# EAGLE design controle (EAGLE 4.11)
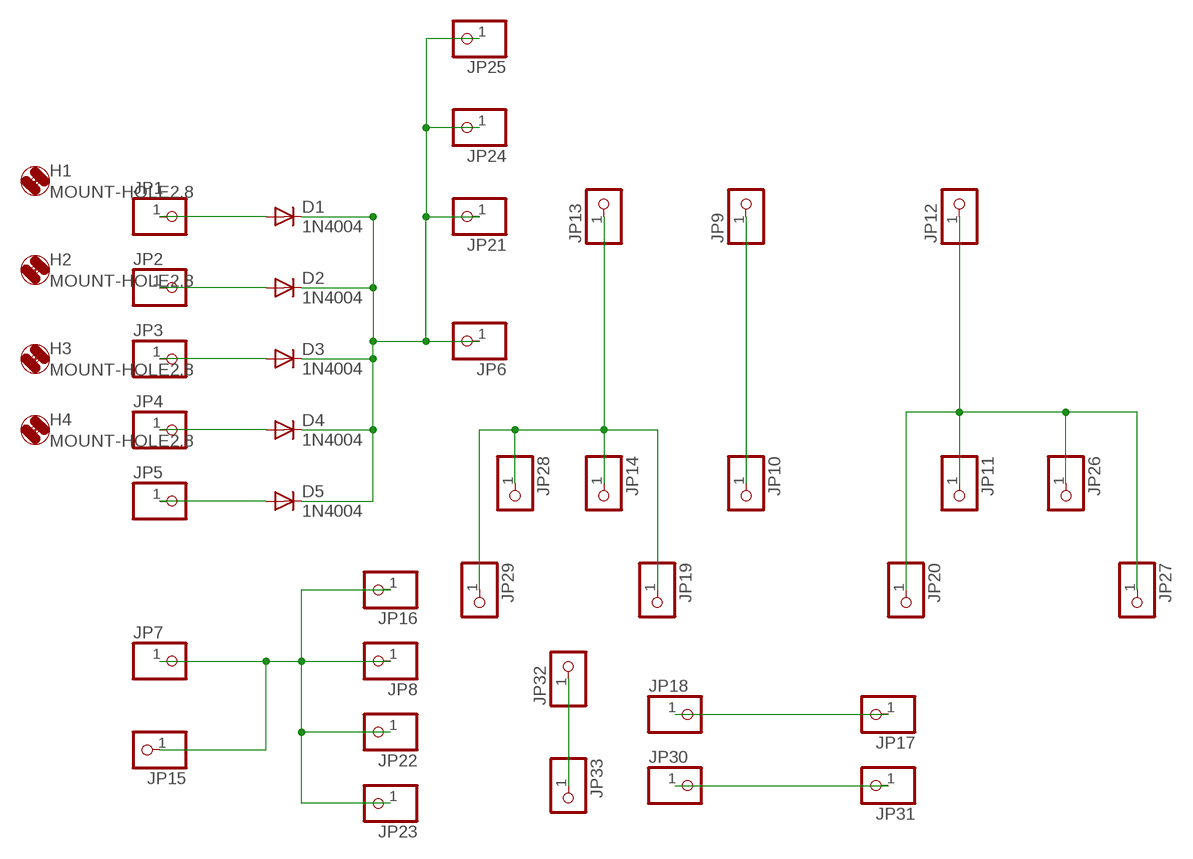
[diagram p0: schematic, sheet 1]

## Parts
D1  1N4004  [DO41-10]
D2  1N4004  [DO41-10]
D3  1N4004  [DO41-10]
D4  1N4004  [DO41-10]
D5  1N4004  [DO41-10]
H1  MOUNT-HOLE2.8  [2,8]
H2  MOUNT-HOLE2.8  [2,8]
H3  MOUNT-HOLE2.8  [2,8]
H4  MOUNT-HOLE2.8  [2,8]
JP1  PINHD-1X1  [1X01]
JP2  PINHD-1X1  [1X01]
JP3  PINHD-1X1  [1X01]
JP4  PINHD-1X1  [1X01]
JP5  PINHD-1X1  [1X01]
JP6  PINHD-1X1  [1X01]
JP7  PINHD-1X1  [1X01]
JP8  PINHD-1X1  [1X01]
JP9  PINHD-1X1  [1X01]
JP10  PINHD-1X1  [1X01]
JP11  PINHD-1X1  [1X01]
JP12  PINHD-1X1  [1X01]
JP13  PINHD-1X1  [1X01]
JP14  PINHD-1X1  [1X01]
JP15  PINHD-1X1  [1X01]
JP16  PINHD-1X1  [1X01]
JP17  PINHD-1X1  [1X01]
JP18  PINHD-1X1  [1X01]
JP19  PINHD-1X1  [1X01]
JP20  PINHD-1X1  [1X01]
JP21  PINHD-1X1  [1X01]
JP22  PINHD-1X1  [1X01]
JP23  PINHD-1X1  [1X01]
JP24  PINHD-1X1  [1X01]
JP25  PINHD-1X1  [1X01]
JP26  PINHD-1X1  [1X01]
JP27  PINHD-1X1  [1X01]
JP28  PINHD-1X1  [1X01]
JP29  PINHD-1X1  [1X01]
JP30  PINHD-1X1  [1X01]
JP31  PINHD-1X1  [1X01]
JP32  PINHD-1X1  [1X01]
JP33  PINHD-1X1  [1X01]

## Nets
N$1: D1.A JP1.1
N$2: D2.A JP2.1
N$3: D3.A JP3.1
N$4: D4.A JP4.1
N$5: D5.A JP5.1
N$6: JP7.1 JP8.1 JP15.1 JP16.1 JP22.1 JP23.1
N$7: D1.C D2.C D3.C D4.C D5.C JP6.1 JP21.1 JP24.1 JP25.1
N$8: JP13.1 JP14.1 JP19.1 JP28.1 JP29.1
N$9: JP9.1 JP10.1
N$10: JP11.1 JP12.1 JP20.1 JP26.1 JP27.1
N$11: JP32.1 JP33.1
N$13: JP17.1 JP18.1
N$14: JP30.1 JP31.1

## Library data of the parts
D1-D5 = diode:1N4004: DIODE general purpose rectifier, 1 A
H1-H4 = holes:MOUNT-HOLE: MOUNTING HOLE with drill center marker
JP1-JP33 = pinhead:PINHD-1X1: PIN HEADER

## Board
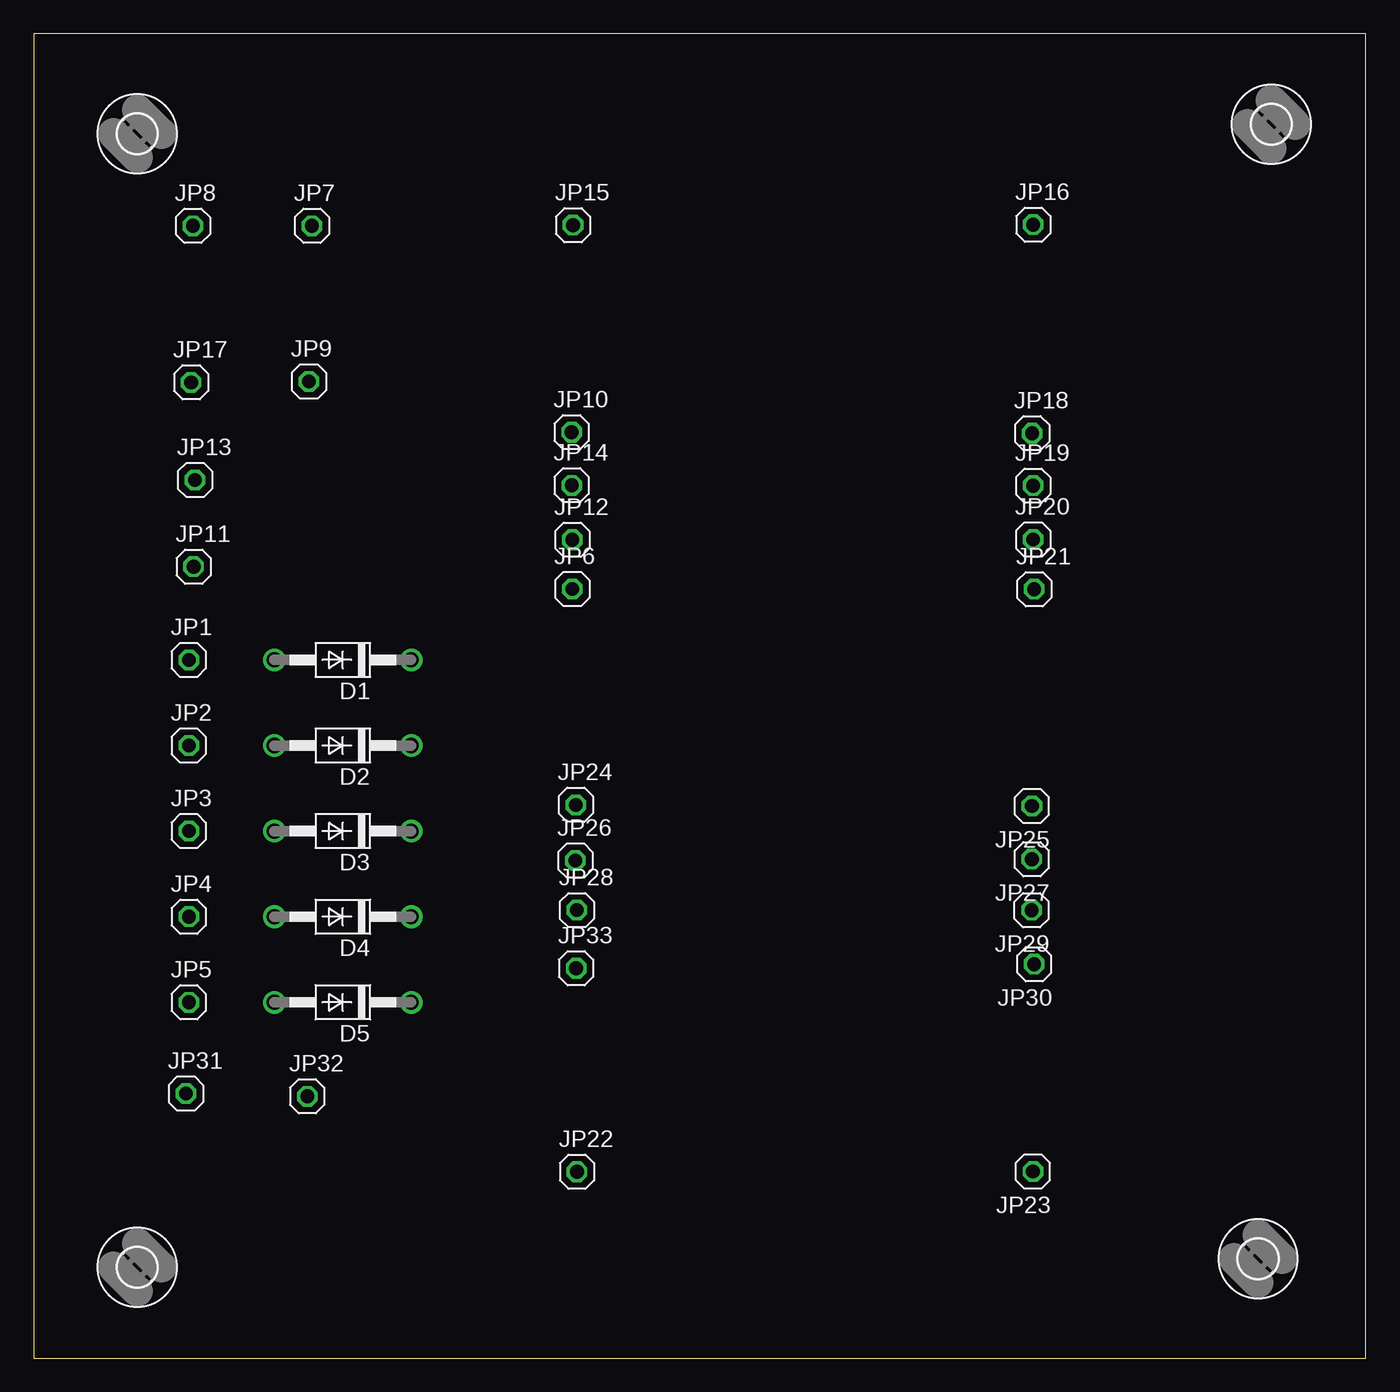
[diagram p1: board, top side]
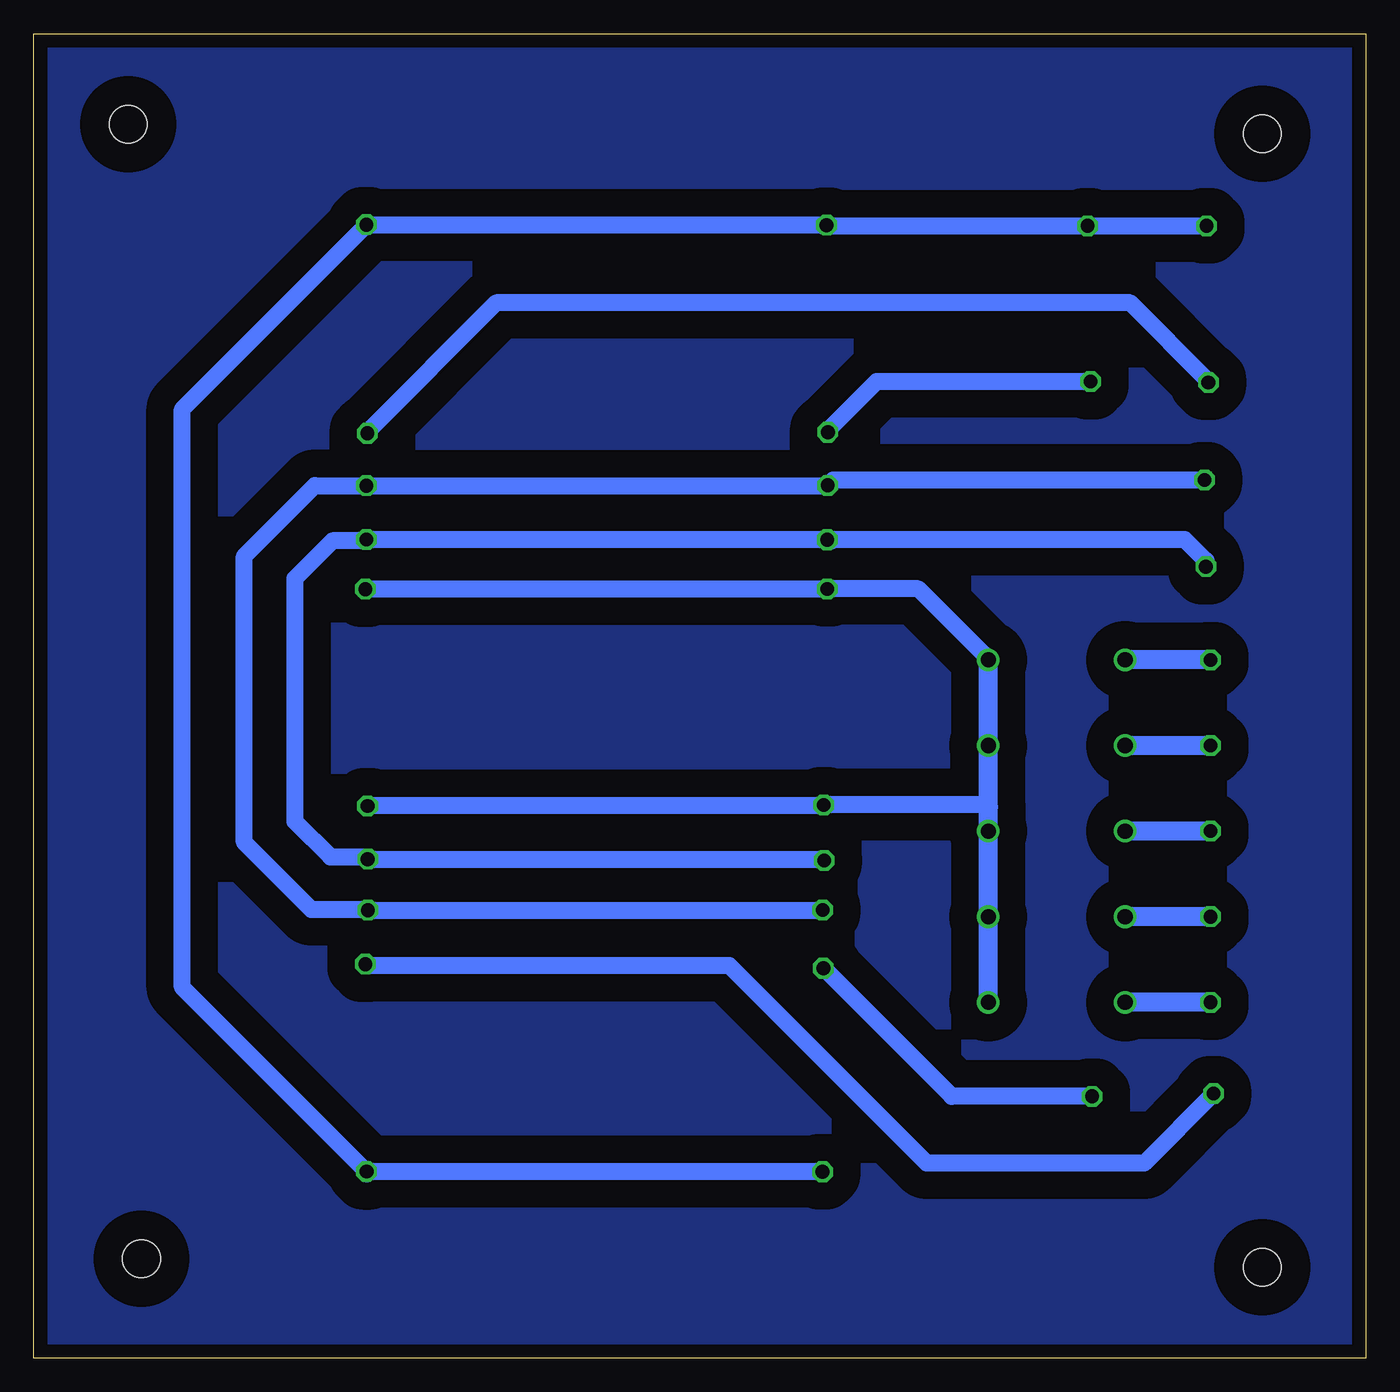
[diagram p2: board, bottom side, seen from below]

Size 98.85 x 98.24 mm. Coordinates in mm from the lower left corner, seen from the top.
Outline: 0,0 98.85,0 98.85,98.24 0,98.24 0,0
Copper layers (1*16): Top 0.035mm / dielectric 1.5mm / Bottom 0.035mm
Design rules "default": minimum track width 10mil, minimum drill 24mil, track to track 80mil, track to pad 80mil, pad to pad 80mil, via to via 80mil, smd to smd 80mil, copper to edge 40mil, drill to drill 8mil, minimum pad ring 10mil, minimum via ring 8mil, stop-mask expansion 4mil, vias tented up to drill 0mil, thermal gap 10mil

### Footprints (pad centres in the part's own frame; a part is rotated, then mirrored left to right if it is on the bottom)
DO41-10 = drill 1.118 round: A 5.08,0; C -5.08,0
2,8 = hole 2.8: 0,0
1X01 = drill 1.016 octagon: 1 0,0

### Placement (x,y rotation side)
D1  22.94,51.79 180 top
D2  22.94,45.44 180 top
D3  22.94,39.09 180 top
D4  22.94,32.74 180 top
D5  22.94,26.39 180 top
H1  90.85,7.37 0 top
H2  91.84,91.52 0 top
H3  7.69,6.74 0 top
H4  7.69,90.82 0 top
JP1  11.51,51.79 0 top
JP2  11.51,45.44 0 top
JP3  11.51,39.09 0 top
JP4  11.51,32.74 0 top
JP5  11.51,26.39 0 top
JP6  39.97,57.05 0 top
JP7  20.65,83.99 0 top
JP8  11.81,83.99 0 top
JP9  20.42,72.44 0 top
JP10  39.91,68.68 0 top
JP11  11.87,58.7 0 top
JP12  39.96,60.7 0 top
JP13  11.97,65.14 0 top
JP14  39.92,64.74 0 top
JP15  40.02,84.03 0 top
JP16  74.17,84.07 0 top
JP17  11.68,72.38 0 top
JP18  74.08,68.6 0 top
JP19  74.16,64.71 0 top
JP20  74.16,60.72 0 top
JP21  74.24,57.03 0 top
JP22  40.31,13.82 0 top
JP23  74.15,13.84 180 top
JP24  40.22,41.04 0 top
JP25  74.07,40.96 180 top
JP26  40.2,36.9 0 top
JP27  74.07,37.01 180 top
JP28  40.31,33.23 0 top
JP29  74.04,33.22 180 top
JP30  74.25,29.22 180 top
JP31  11.3,19.62 0 top
JP32  20.3,19.42 0 top
JP33  40.25,28.92 0 top

### Tracks (layer width: path | path; a pad name or v marks a point on that pad's centre or on a via)
N$1
  Bottom 1.422: JP1.1 D1.A
N$2
  Bottom 1.422: JP2.1 D2.A
N$3
  Bottom 1.422: JP3.1 D3.A
N$4
  Bottom 1.422: JP4.1 D4.A
N$5
  Bottom 1.422: JP5.1 D5.A
N$6  (via drill 0.61)
  Bottom 1.27: JP7.1 JP8.1 | JP7.1 v20.68,83.97 | 40.26,83.99 40.22,84.03 JP15.1 v40.02,83.98 v40.03,83.97 40.13,84.07 JP16.1 v74.17,84.03 v74.18,84.02 87.83,70.37 87.83,27.52 JP23.1 74.15,13.69 74.13,13.67 73.98,13.82 JP22.1 | 40.26,83.99 JP7.1 | 40.26,83.99 40.28,83.97
N$7
  Bottom 1.27: 27.95,51.79 27.93,51.77 | D1.C 27.95,51.79 | 27.95,51.79 33.21,57.05 JP6.1 39.95,57.03 | 39.95,57.03 JP21.1 | 39.95,57.03 39.93,57.02 | 28.02,40.87 27.93,40.87 28.1,41.04 JP24.1 40.23,40.96 40.22,40.95 | 40.22,40.95 JP25.1 | 40.22,40.95 40.18,40.92
  Bottom 1.422: D5.C D4.C D3.C 28.02,40.87 D2.C D1.C
N$8  (via drill 0.61)
  Bottom 1.27: JP13.1 39.51,65.14 v39.88,64.77 JP14.1 | JP14.1 | JP14.1 39.94,64.72 JP19.1 77.99,64.72 83.23,59.47 83.23,38.27 78.23,33.27 74.13,33.27 | JP29.1 74.04,33.26 74.03,33.27 74.13,33.27 | 74.13,33.27 74.13,33.17 40.37,33.17 JP28.1
N$9
  Bottom 1.27: JP10.1 39.99,68.68 40.03,68.72 36.31,72.44 JP9.1
N$10
  Bottom 1.27: JP11.1 11.87,59.16 13.43,60.72 39.58,60.72 39.68,60.62 39.76,60.7 JP12.1 74.05,60.7 74.13,60.62 | 74.13,60.62 74.16,60.65 JP20.1 | 74.13,60.62 76.68,60.62 79.48,57.82 79.48,39.82 76.83,37.17 74.28,37.17 74.12,37.01 JP27.1 74.05,37.02 40.31,37.02 JP26.1
N$11  (via drill 0.61)
  Bottom 1.27: 40.25,28.94 40.28,28.97 | 40.25,28.94 JP33.1 | JP32.1 v20.33,19.42 30.73,19.42 40.25,28.94
N$12
  pour Bottom: 0.63,0.47 98,0.47 98.5,97.46 1.13,97.46
N$13
  Bottom 1.27: JP17.1 11.68,72.47 17.48,78.27 64.53,78.27 74.2,68.6 | 74.2,68.6 74.23,68.57 | 74.2,68.6 JP18.1
N$14
  Bottom 1.27: JP31.1 16.45,14.47 32.58,14.47 47.23,29.12 74.28,29.12 74.28,29.19 JP30.1
N$15  (via drill 0.61)
  other vias: 11.83,83.97
N$16  (via drill 0.61)
  other vias: 20.48,72.47
N$17  (via drill 0.61)
  other vias: 11.68,72.37
N$18  (via drill 0.61)
  other vias: 39.93,68.72
N$19  (via drill 0.61)
  other vias: 74.08,68.62
N$20  (via drill 0.61)
  other vias: 74.13,64.72
N$21  (via drill 0.61)
  other vias: 74.18,60.72
N$22  (via drill 0.61)
  other vias: 74.28,56.97
N$23  (via drill 0.61)
  other vias: 39.98,60.67
N$24  (via drill 0.61)
  other vias: 39.98,57.07
N$25  (via drill 0.61)
  other vias: 11.53,51.77
N$26  (via drill 0.61)
  other vias: 11.53,45.42
N$27  (via drill 0.61)
  other vias: 11.53,39.12
N$28  (via drill 0.61)
  other vias: 17.88,51.82
N$29  (via drill 0.61)
  other vias: 27.98,51.77
N$30  (via drill 0.61)
  other vias: 28.03,45.42
N$31  (via drill 0.61)
  other vias: 28.03,39.07
N$32  (via drill 0.61)
  other vias: 17.83,39.12
N$33  (via drill 0.61)
  other vias: 17.88,45.42
N$34  (via drill 0.61)
  other vias: 40.18,41.02
N$35  (via drill 0.61)
  other vias: 40.23,36.92
N$36  (via drill 0.61)
  other vias: 40.33,33.22
N$37  (via drill 0.61)
  other vias: 40.28,28.92
N$38  (via drill 0.61)
  other vias: 11.53,32.72
N$39  (via drill 0.61)
  other vias: 11.53,26.32
N$40  (via drill 0.61)
  other vias: 17.88,26.42
N$41  (via drill 0.61)
  other vias: 17.88,32.72
N$42  (via drill 0.61)
  other vias: 28.08,32.72
N$43  (via drill 0.61)
  other vias: 28.03,26.42
N$44  (via drill 0.61)
  other vias: 11.83,58.67
N$45  (via drill 0.61)
  other vias: 11.93,65.22
N$46  (via drill 0.61)
  other vias: 11.28,19.62
N$47  (via drill 0.61)
  other vias: 40.33,13.82
N$48  (via drill 0.61)
  other vias: 74.13,13.82
N$49  (via drill 0.61)
  other vias: 74.28,29.22
N$50  (via drill 0.61)
  other vias: 74.03,33.22
N$51  (via drill 0.61)
  other vias: 74.08,37.02
N$52  (via drill 0.61)
  other vias: 74.08,40.92